# Altium schematic sheet 08_FPGA_HSIO_B3.SchDoc
size A3; DocumentNumber: 8; SheetNumber: 8; SheetTotal: 21
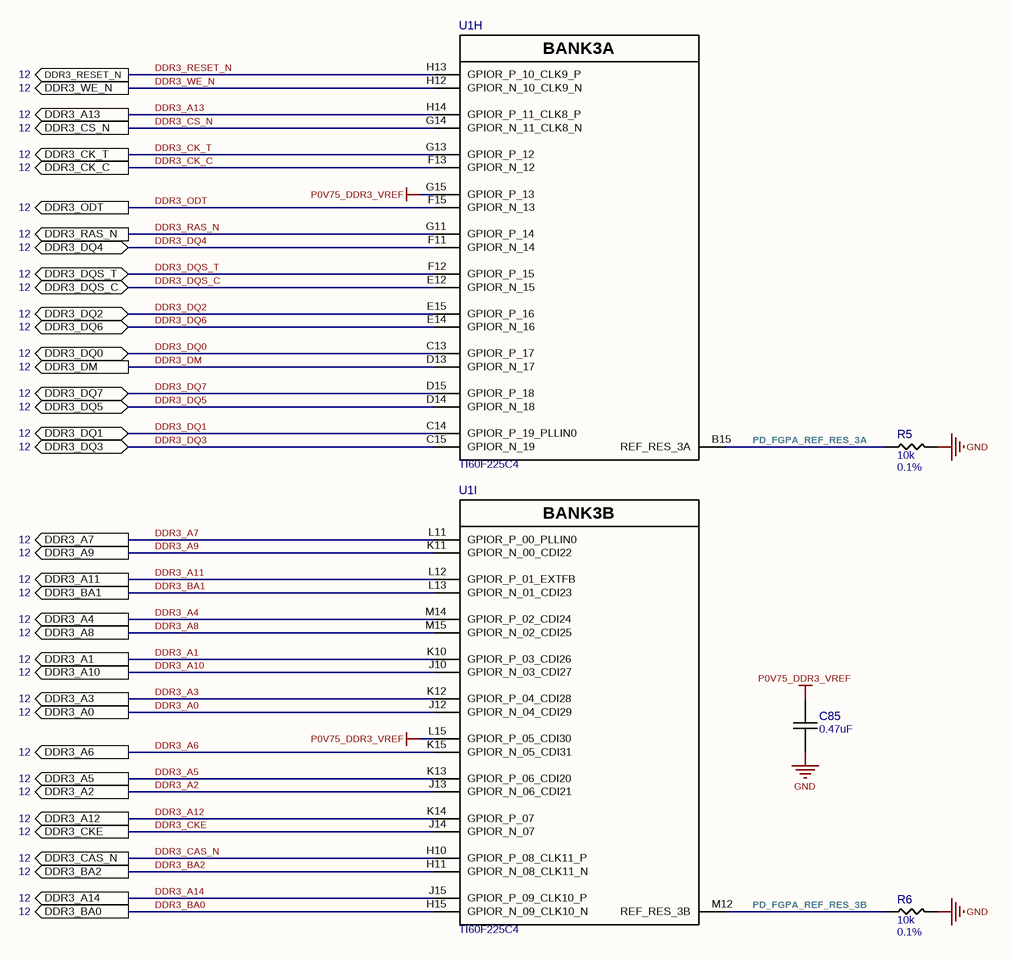
[diagram p0: 08_FPGA_HSIO_B3.SchDoc]

## Parts
C85  0.47uF  [CAPC0603X03N]
R5  10k  Tol: 0.1%  [RESC1005X03N]
R6  10k  Tol: 0.1%  [RESC1005X03N]
U1  TI60F225C4  [BGA225C65P15X15_1000X1000X100]  (parts H,I of 13)

## Ports
DDR3_A0 (out, see 12), DDR3_A1 (out, see 12), DDR3_A2 (out, see 12), DDR3_A3 (out, see 12), DDR3_A4 (out, see 12), DDR3_A5 (out, see 12), DDR3_A6 (out, see 12), DDR3_A7 (out, see 12), DDR3_A8 (out, see 12), DDR3_A9 (out, see 12), DDR3_A10 (out, see 12), DDR3_A11 (out, see 12), DDR3_A12 (out, see 12), DDR3_A13 (out, see 12), DDR3_A14 (out, see 12), DDR3_BA0 (out, see 12), DDR3_BA1 (out, see 12), DDR3_BA2 (out, see 12), DDR3_CAS_N (out, see 12), DDR3_CK_C (out, see 12), DDR3_CK_T (out, see 12), DDR3_CKE (out, see 12), DDR3_CS_N (out, see 12), DDR3_DM (out, see 12), DDR3_DQ0 (bidir, see 12), DDR3_DQ1 (bidir, see 12), DDR3_DQ2 (bidir, see 12), DDR3_DQ3 (bidir, see 12), DDR3_DQ4 (bidir, see 12), DDR3_DQ5 (bidir, see 12), DDR3_DQ6 (bidir, see 12), DDR3_DQ7 (bidir, see 12), DDR3_DQS_C (bidir, see 12), DDR3_DQS_T (bidir, see 12), DDR3_ODT (out, see 12), DDR3_RAS_N (out, see 12), DDR3_RESET_N (out, see 12), DDR3_WE_N (out, see 12)

## Nets
GND: C85.1 R5.2 R6.2
P0V75_DDR3_VREF: C85.2 U1.G15(GPIOR_P_13) U1.L15(GPIOR_P_05_CDI30)
DDR3_A0: U1.J12(GPIOR_N_04_CDI29) ; port DDR3_A0
DDR3_A1: U1.K10(GPIOR_P_03_CDI26) ; port DDR3_A1
DDR3_A2: U1.J13(GPIOR_N_06_CDI21) ; port DDR3_A2
DDR3_A3: U1.K12(GPIOR_P_04_CDI28) ; port DDR3_A3
DDR3_A4: U1.M14(GPIOR_P_02_CDI24) ; port DDR3_A4
DDR3_A5: U1.K13(GPIOR_P_06_CDI20) ; port DDR3_A5
DDR3_A6: U1.K15(GPIOR_N_05_CDI31) ; port DDR3_A6
DDR3_A7: U1.L11(GPIOR_P_00_PLLIN0) ; port DDR3_A7
DDR3_A8: U1.M15(GPIOR_N_02_CDI25) ; port DDR3_A8
DDR3_A9: U1.K11(GPIOR_N_00_CDI22) ; port DDR3_A9
DDR3_A10: U1.J10(GPIOR_N_03_CDI27) ; port DDR3_A10
DDR3_A11: U1.L12(GPIOR_P_01_EXTFB) ; port DDR3_A11
DDR3_A12: U1.K14(GPIOR_P_07) ; port DDR3_A12
DDR3_A13: U1.H14(GPIOR_P_11_CLK8_P) ; port DDR3_A13
DDR3_A14: U1.J15(GPIOR_P_09_CLK10_P) ; port DDR3_A14
DDR3_BA0: U1.H15(GPIOR_N_09_CLK10_N) ; port DDR3_BA0
DDR3_BA1: U1.L13(GPIOR_N_01_CDI23) ; port DDR3_BA1
DDR3_BA2: U1.H11(GPIOR_N_08_CLK11_N) ; port DDR3_BA2
DDR3_CAS_N: U1.H10(GPIOR_P_08_CLK11_P) ; port DDR3_CAS_N
DDR3_CK_C: U1.F13(GPIOR_N_12) ; port DDR3_CK_C
DDR3_CK_T: U1.G13(GPIOR_P_12) ; port DDR3_CK_T
DDR3_CKE: U1.J14(GPIOR_N_07) ; port DDR3_CKE
DDR3_CS_N: U1.G14(GPIOR_N_11_CLK8_N) ; port DDR3_CS_N
DDR3_DM: U1.D13(GPIOR_N_17) ; port DDR3_DM
DDR3_DQ0: U1.C13(GPIOR_P_17) ; port DDR3_DQ0
DDR3_DQ1: U1.C14(GPIOR_P_19_PLLIN0) ; port DDR3_DQ1
DDR3_DQ2: U1.E15(GPIOR_P_16) ; port DDR3_DQ2
DDR3_DQ3: U1.C15(GPIOR_N_19) ; port DDR3_DQ3
DDR3_DQ4: U1.F11(GPIOR_N_14) ; port DDR3_DQ4
DDR3_DQ5: U1.D14(GPIOR_N_18) ; port DDR3_DQ5
DDR3_DQ6: U1.E14(GPIOR_N_16) ; port DDR3_DQ6
DDR3_DQ7: U1.D15(GPIOR_P_18) ; port DDR3_DQ7
DDR3_DQS_C: U1.E12(GPIOR_N_15) ; port DDR3_DQS_C
DDR3_DQS_T: U1.F12(GPIOR_P_15) ; port DDR3_DQS_T
DDR3_ODT: U1.F15(GPIOR_N_13) ; port DDR3_ODT
DDR3_RAS_N: U1.G11(GPIOR_P_14) ; port DDR3_RAS_N
DDR3_RESET_N: U1.H13(GPIOR_P_10_CLK9_P) ; port DDR3_RESET_N
DDR3_WE_N: U1.H12(GPIOR_N_10_CLK9_N) ; port DDR3_WE_N
PD_FGPA_REF_RES_3A: R5.1 U1.B15(REF_RES_3A)
PD_FGPA_REF_RES_3B: R6.1 U1.M12(REF_RES_3B)

## Notes on the sheet
- (in symbol TI60F225C4, part H) BANK3A
- (in symbol TI60F225C4, part I) BANK3B

## Library data of the parts
C85 = GRM033R60J474KE90D: CAP CER 0.47UF 6.3V X5R 0201; Manufacturer 1: Murata Electronics; Tol: 10%; Part Number: GRM033R60J474KE90D; Value: 0.47uF; Voltage: 6.3V; TempC: X5R; Manufacturer Part Number 1: GRM033R60J474KE90D; Supplier 1: Digi-Key; Supplier Part Number 1: 490-10409-1-ND
R5 R6 = RT0402BRD0710KL: RES SMD 10K OHM 0.1% 1/16W 0402; Manufacturer 1: Yageo; Part Number: RT0402BRD0710KL; Value: 10k; Manufacturer Part Number 1: RT0402BRD0710KL; Supplier 1: Digi-Key; Supplier Part Number 1: YAG1346CT-ND
U1 = TI60F225C4: FPGA TITAN 140HSIO 4PLL 225BGA; Manufacturer 1: Efinix, Inc.; Part Number: TI60F225C4; Manufacturer Part Number 1: TI60F225C4; Supplier 1: Digi-Key; Supplier Part Number 1: 2134-TI60F225C4-ND